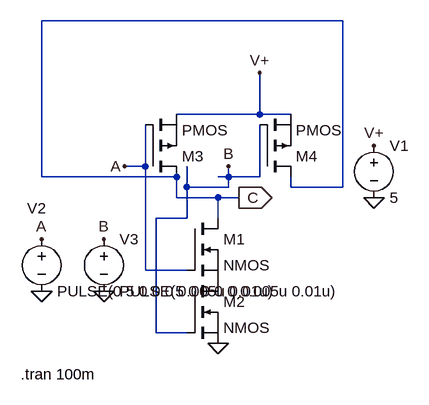
[diagram p0: schematic R4.11.17CMOS_NAND.asc]
R4.11.17CMOS_NAND.asc, the LTspice schematic file:
Version 4
SHEET 1 880 680
WIRE 336 -256 -128 -256
WIRE 208 -112 208 -176
WIRE 208 -112 80 -112
WIRE 256 -112 208 -112
WIRE 32 -32 32 -96
WIRE 32 -32 0 -32
WIRE -128 -16 -128 -256
WIRE 80 -16 -128 -16
WIRE 160 -16 160 -32
WIRE 160 -16 144 -16
WIRE 208 -16 208 -96
WIRE 208 -16 160 -16
WIRE 96 0 96 -32
WIRE 160 0 160 -16
WIRE 160 0 96 0
WIRE 256 0 256 -16
WIRE 336 0 336 -256
WIRE 336 0 256 0
WIRE 80 16 80 -16
WIRE 144 16 80 16
WIRE 176 16 144 16
WIRE 96 48 96 0
WIRE 96 48 48 48
WIRE 144 48 144 16
WIRE 32 128 32 -32
WIRE 96 128 32 128
WIRE 48 224 48 48
WIRE 96 224 48 224
FLAG 208 -176 V+
FLAG 144 240 0
FLAG 0 -32 A
FLAG 160 -32 B
FLAG -32 80 B
FLAG -128 80 A
FLAG 384 -64 V+
FLAG 384 16 0
FLAG -128 160 0
FLAG -32 160 0
FLAG 176 16 C
IOPIN 176 16 Out
SYMBOL nmos 96 48 R0
SYMATTR InstName M1
SYMBOL nmos 96 144 R0
SYMATTR InstName M2
SYMBOL pmos 32 -16 M180
SYMATTR InstName M3
SYMBOL pmos 208 -16 M180
SYMATTR InstName M4
SYMBOL voltage 384 -80 R0
WINDOW 123 0 0 Left 0
WINDOW 39 0 0 Left 0
SYMATTR InstName V1
SYMATTR Value 5
SYMBOL voltage -128 64 R0
WINDOW 0 -22 -32 Left 2
WINDOW 123 0 0 Left 0
WINDOW 39 0 0 Left 0
SYMATTR InstName V2
SYMATTR Value PULSE(0 5 0 0 0 0.005u 0.01u)
SYMBOL voltage -32 64 R0
WINDOW 123 0 0 Left 0
WINDOW 39 0 0 Left 0
SYMATTR InstName V3
SYMATTR Value PULSE(5 0 0 0 0 0.005u 0.01u)
TEXT -160 288 Left 2 !.tran 100m

The netlist it stands for:
* R4.11.17CMOS_NAND.asc
M1 C A P001 P001 NMOS
M2 P001 B 0 0 NMOS
M3 C A V+ V+ PMOS
M4 C B V+ V+ PMOS
V1 V+ 0 5
V2 A 0 PULSE(0 5 0 0 0 0.005u 0.01u)
V3 B 0 PULSE(5 0 0 0 0 0.005u 0.01u)
.model NMOS NMOS
.model PMOS PMOS
.lib standard.mos
.tran 100m
.backanno
.end